# EAGLE design power_router (EAGLE 9.6.2)
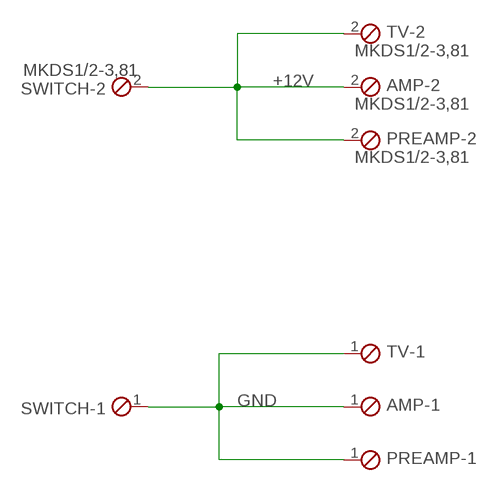
[diagram p0: schematic, sheet 1]

## Parts
AMP  MKDS1/2-3,81  [2POL381]
PREAMP  MKDS1/2-3,81  [2POL381]
SWITCH  MKDS1/2-3,81  [2POL381]
TV  MKDS1/2-3,81  [2POL381]

## Nets
+12V: AMP.2 PREAMP.2 SWITCH.2 TV.2
GND: AMP.1 PREAMP.1 SWITCH.1 TV.1

## Library data of the parts
AMP PREAMP SWITCH TV = con-phoenix-381:MKDS1/2-3,81: MKDS 1/2-3,81 - Order No. 1727010 (RS-Online - 101-5384) Pitch: 3,81mm Number of terminals: 2 Rated Voltage: 160V Maximum load current/ cross section: 12A/1.5mm2-AWG16 Housing Interlocking: none Color: Green

## Board
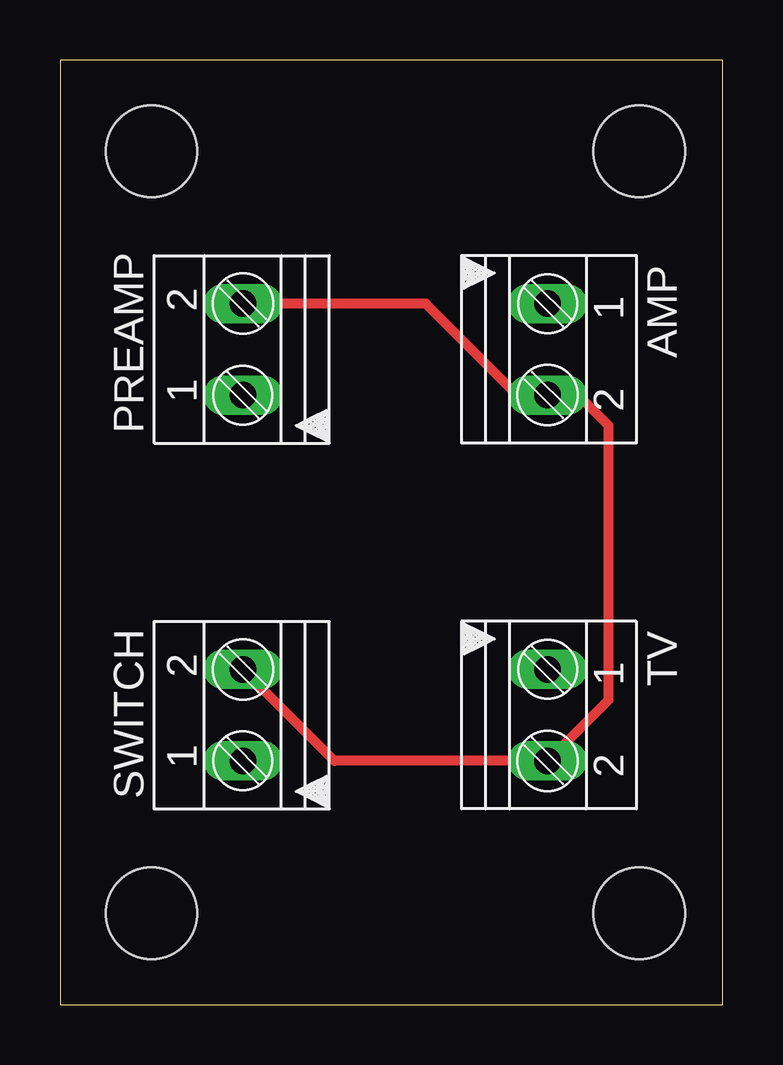
[diagram p1: board, top side]
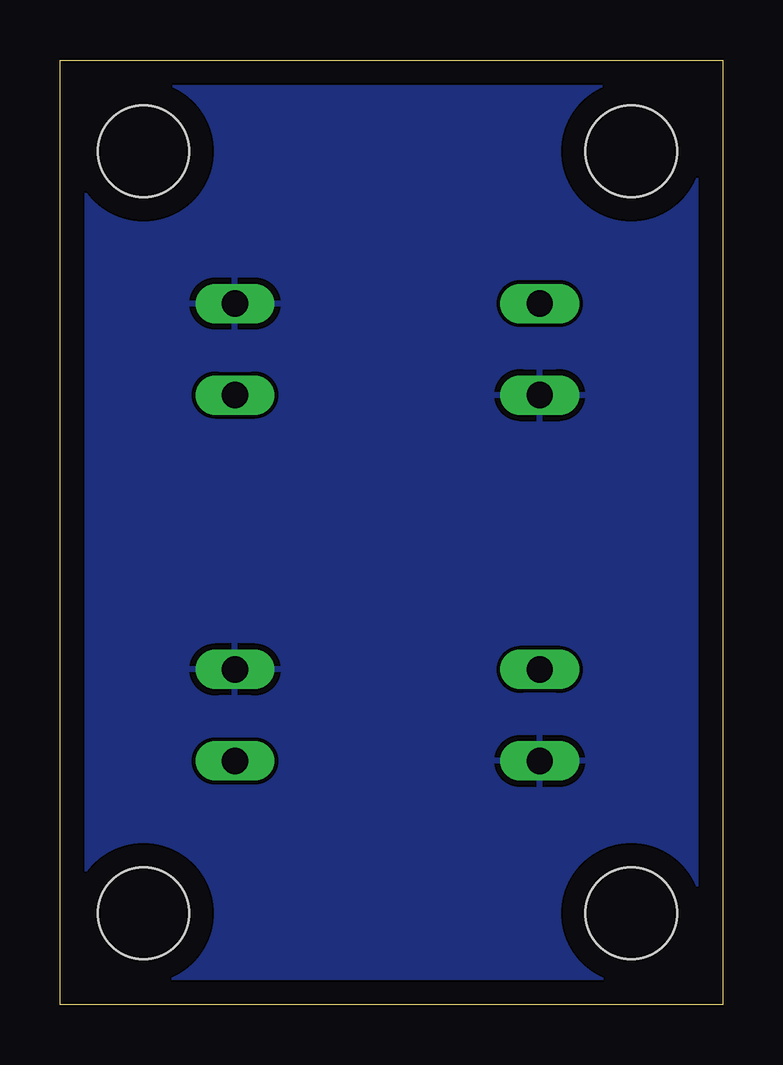
[diagram p2: board, bottom side, seen from below]

Size 27.61 x 39.36 mm. Coordinates in mm from the lower left corner, seen from the top.
Outline: 0,0 27.61,0 27.61,39.36 0,39.36 0,0
Copper layers (1*16): Top 0.035mm / dielectric 1.5mm / Bottom 0.035mm
Design rules "default": minimum track width 6mil, minimum drill 0.35mm, track to track 6mil, track to pad 6mil, pad to pad 6mil, via to via 6mil, smd to smd 6mil, copper to edge 40mil, drill to drill 6mil, minimum pad ring 10mil, minimum via ring 8mil, stop-mask expansion 4mil, vias tented up to drill 0mil, thermal gap 10mil
Holes 3.81 mm at 3.81,35.56 3.81,3.81 24.13,35.56 24.13,3.81

### Footprints (pad centres in the part's own frame; a part is rotated, then mirrored left to right if it is on the bottom)
2POL381 = drill 1.1 long: 1 0,0; 2 3.81,0

### Placement (x,y rotation side)
AMP  20.32,29.21 270 top
PREAMP  7.62,25.4 90 top
SWITCH  7.62,10.16 90 top
TV  20.32,13.97 270 top

### Tracks (layer width: path | path; a pad name or v marks a point on that pad's centre or on a via)
+12V
  Top 0.406: PREAMP.2 15.24,29.21 19.05,25.4 AMP.2 21.59,25.4 22.86,24.13 22.86,12.7 TV.2 11.43,10.16 SWITCH.2
GND
  pour Bottom: 0,0 0,39.37 27.94,39.37 27.94,0